# Altium schematic sheet blockSys.SchDoc: Block Nano IO Board
size A4; Date: 27/08/2023; CheckedBy: OK; DrawnBy: vsubas; Engineer: vsubas; Revision: 01; SheetNumber: 1; SheetTotal: 2
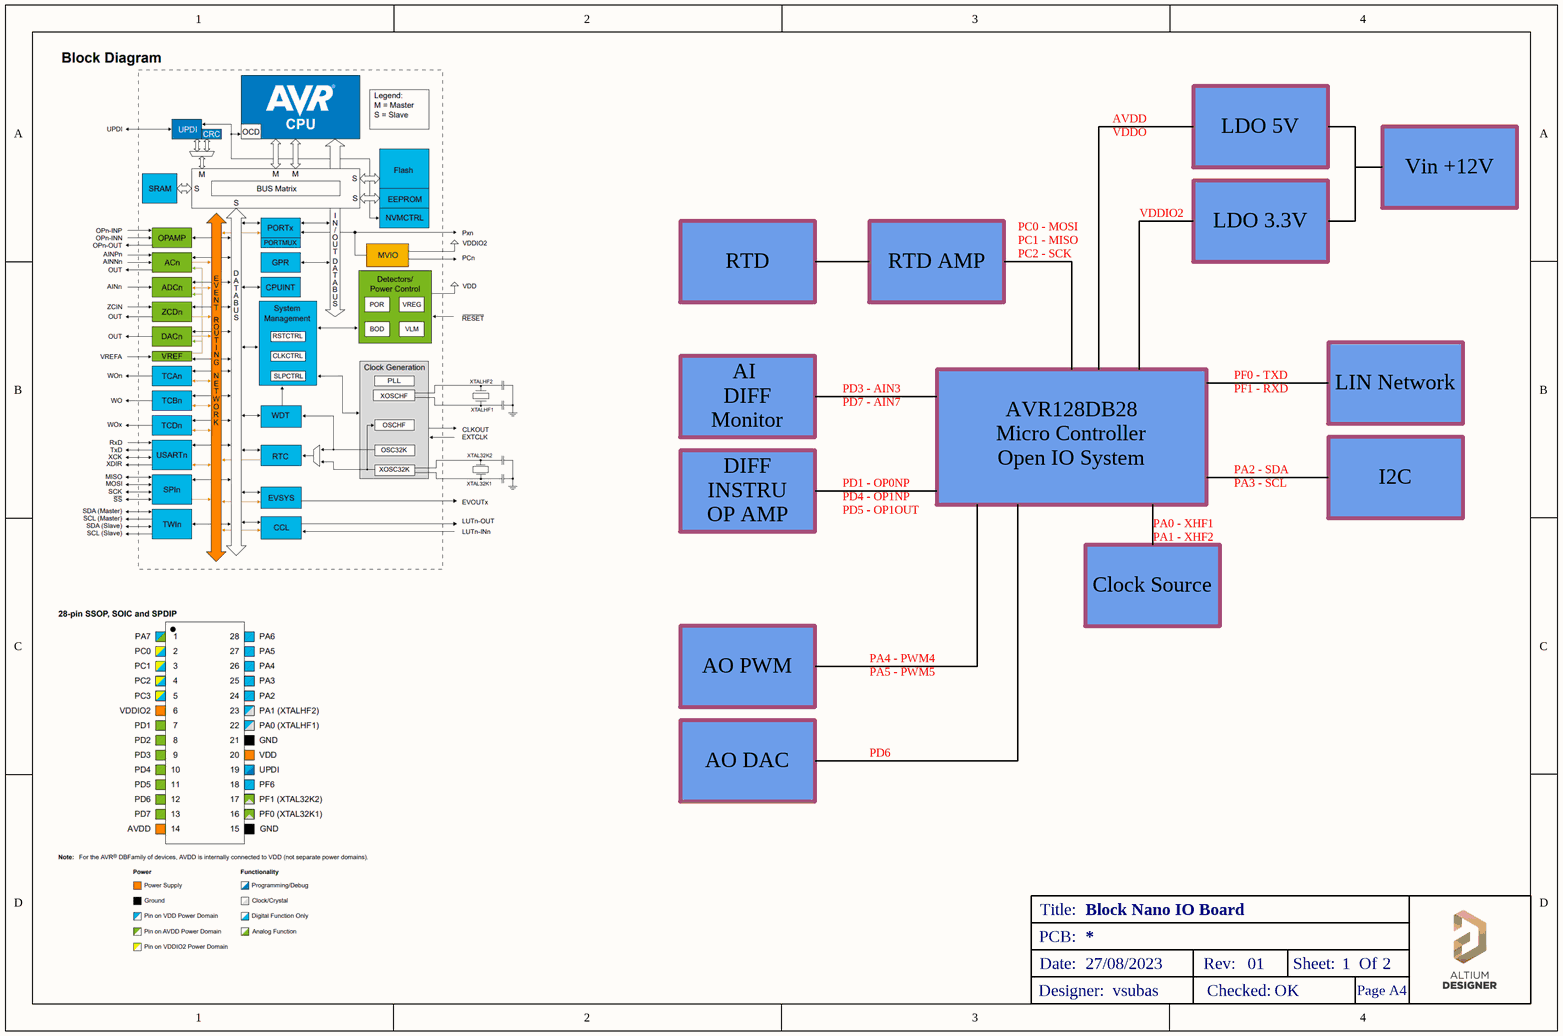
[diagram p0: blockSys.SchDoc]

## Notes on the sheet
- AVDD
- VDDO
- LDO 5V
- PC0 - MOSI
- PC1 - MISO
- VDDIO2
- Vin +12V
- RTD
- RTD AMP
- PC2 - SCK
- LDO 3.3V
- PF0 - TXD
- AI
  DIFF
  Monitor
- PD3 - AIN3
- PD7 - AIN7
- PF1 - RXD
- LIN Network
- PD1 - OP0NP
- PD5 - OP1OUT
- PD4 - OP1NP
- AVR128DB28
  Micro Controller
  Open IO System
- PA2 - SDA
- PA3 - SCL
- I2C
- DIFF
  INSTRU
  OP AMP
- PA0 - XHF1
- PA1 - XHF2
- Clock Source
- AO PWM
- PA4 - PWM4
- PA5 - PWM5
- PD6
- AO DAC
- Title:
- Date:
- PCB:
- Designer:
- Checked:
- Rev:
- Sheet:
- Of
- Page A4